# EAGLE design PowerAmpTA7270 (EAGLE 6.5.0)
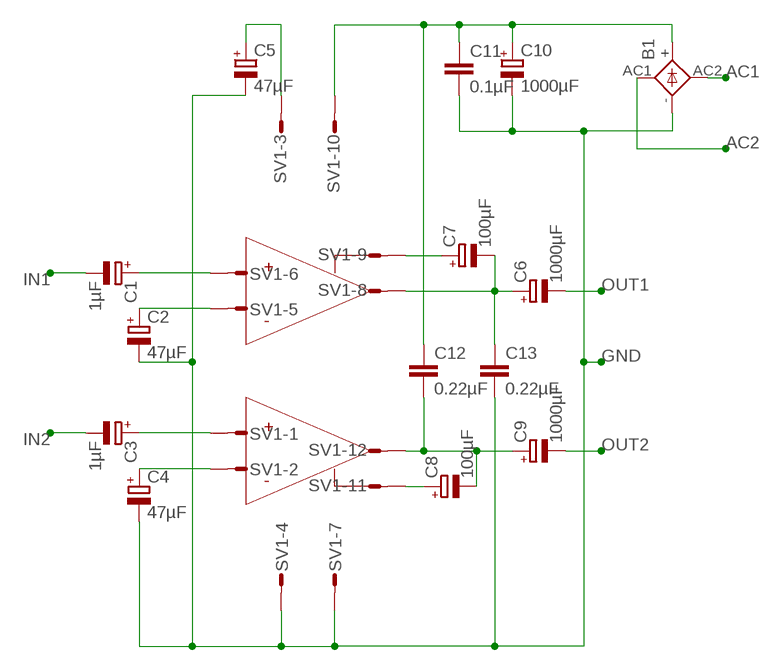
[diagram p0: schematic, sheet 1]

## Parts
B1  FB15A  [FB15A]
C1  1µF  CPOL-EUE15-5AXIAL  [E15-5]
C2  47µF  CPOL-EUB45181B  [B45181B]
C3  1µF  CPOL-EUE15-5AXIAL  [E15-5]
C4  47µF  CPOL-EUB45181B  [B45181B]
C5  47µF  CPOL-EUB45181B  [B45181B]
C6  1000µF  CPOL-EUE5-13  [E5-13]
C7  100µF  CPOL-EUE3.5-10  [E3,5-10]
C8  100µF  CPOL-EUE3.5-10  [E3,5-10]
C9  1000µF  CPOL-EUE5-13  [E5-13]
C10  1000µF  CPOL-EUE45-18AXIAL  [E45-18]
C11  0.1µF  C-EU050-025X075  [C050-025X075]
C12  0.22µF  C-EU050-025X075  [C050-025X075]
C13  0.22µF  C-EU050-025X075  [C050-025X075]
SV1  S12P  [S12P]

## Nets
AC1: B1.AC2
AC2: B1.AC1
GND: B1.- C2.- C4.- C5.- C10.- C11.2 C13.2 SV1.4 SV1.7
IN1: C1.-
IN2: C3.-
N$2: C7.+ SV1.9
N$3: C6.+ C7.- C13.1 SV1.8
N$4: C8.- C9.+ C12.2 SV1.12
N$5: C8.+ SV1.11
N$6: C3.+ SV1.1
N$7: C4.+ SV1.2
N$10: C1.+ SV1.6
N$11: C2.+ SV1.5
N$13: C5.+ SV1.3
OUT1: C6.-
OUT2: C9.-
VCC: B1.+ C10.+ C11.1 C12.1 SV1.10

## Notes on the sheet
- +
- -
- +
- -

## Library data of the parts
B1 = rectifier:FB15A: FAGOR RECTIFIER grid 3 x 5 mm
C1-C10 = rcl:CPOL-EU: POLARIZED CAPACITOR, European symbol
C11-C13 = rcl:C-EU: CAPACITOR, European symbol
SV1 = con-amp-mt:S12P: AMP MT CONNECTOR; OC_FARNELL: unknown; OC_NEWARK: unknown

## Board
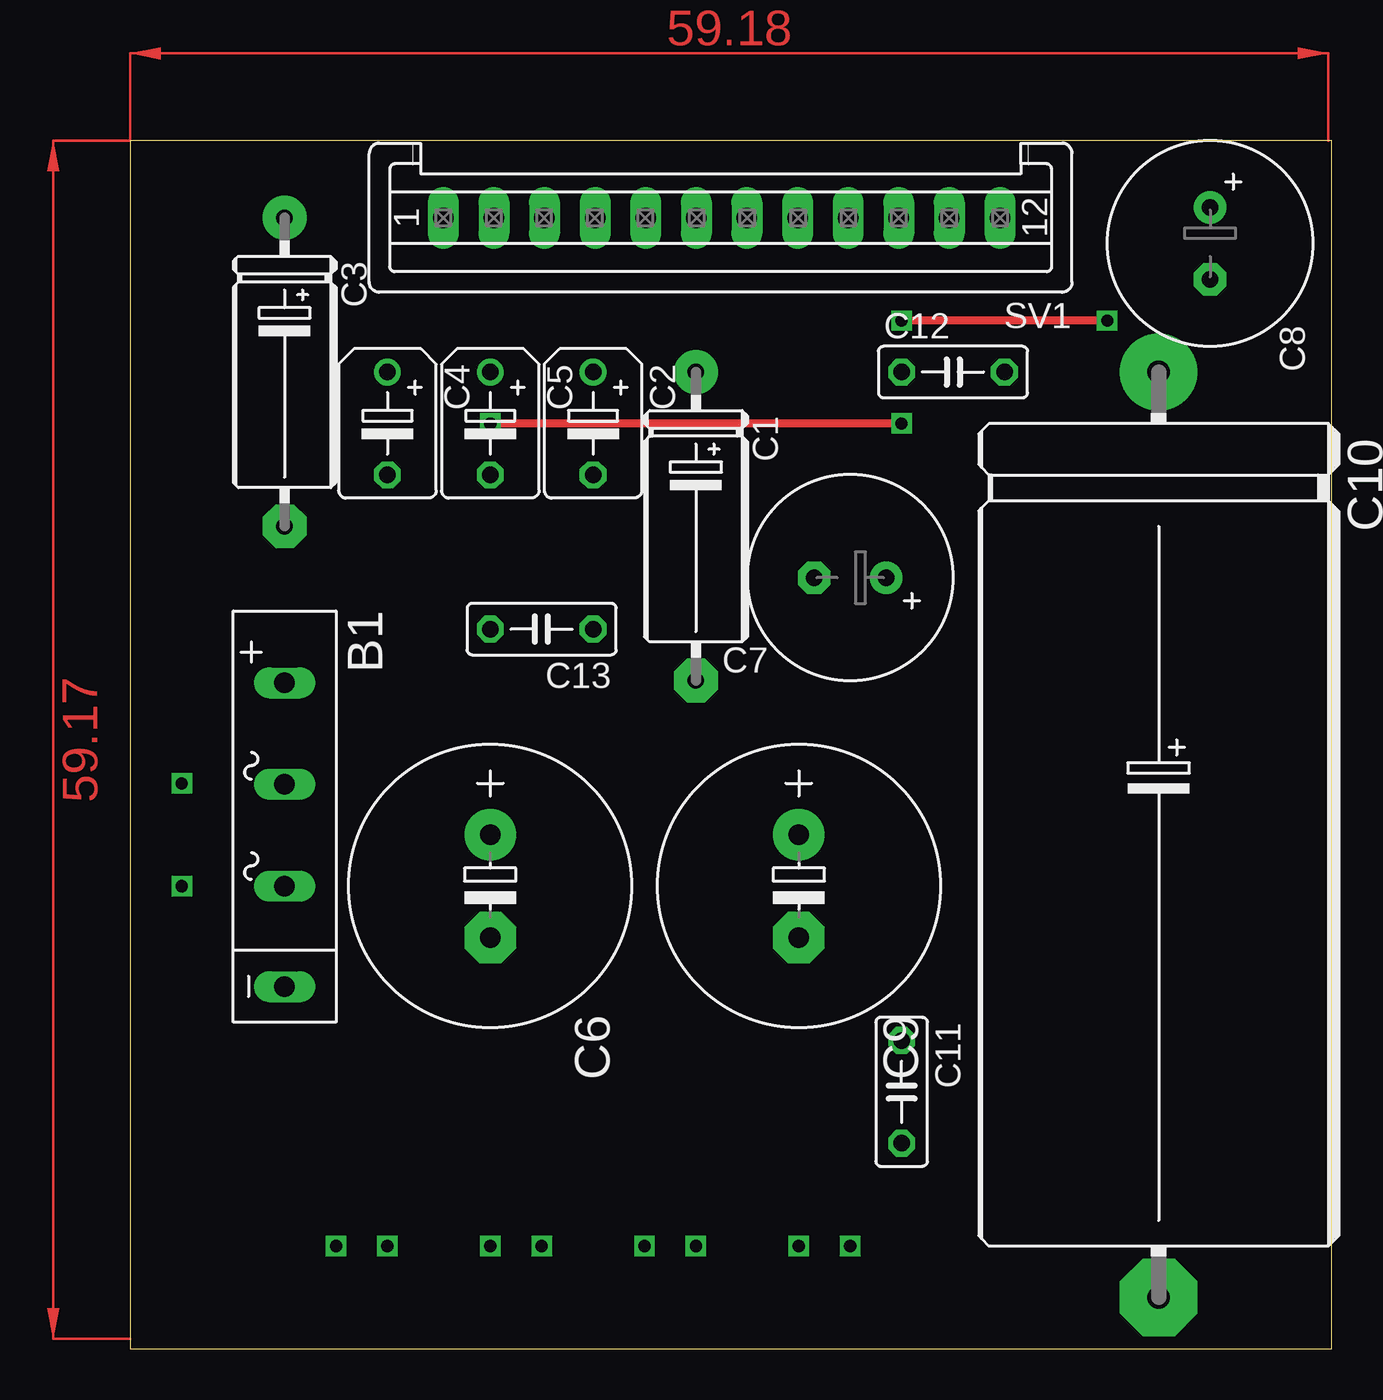
[diagram p1: board, top side]
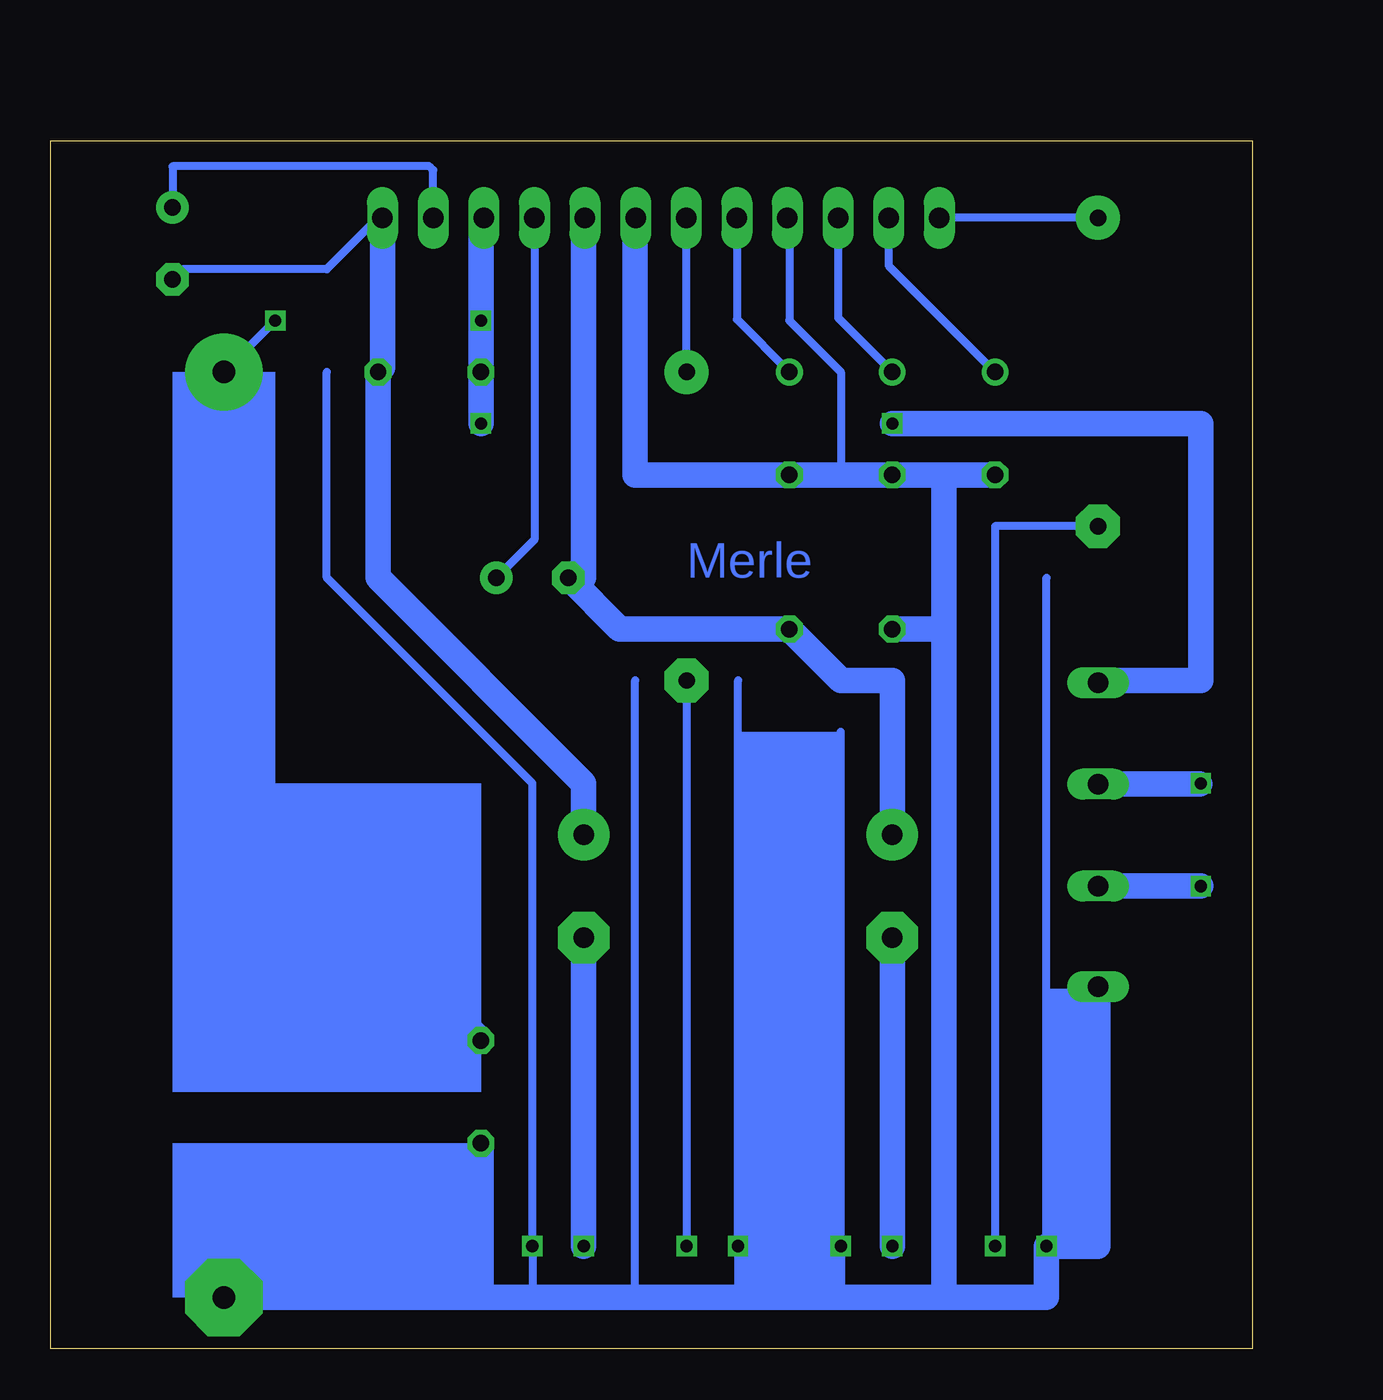
[diagram p2: board, bottom side, seen from below]

Size 59.36 x 59.68 mm. Coordinates in mm from the lower left corner, seen from the top.
Outline: 0,0 59.36,0 59.36,59.68 0,59.68 0,0
Copper layers (1*16): Top 0.035mm / dielectric 1.5mm / Bottom 0.035mm
Design rules "default": minimum track width 10mil, minimum drill 24mil, track to track 8mil, track to pad 8mil, pad to pad 8mil, via to via 8mil, smd to smd 8mil, copper to edge 40mil, drill to drill 8mil, minimum pad ring 10mil, minimum via ring 8mil, stop-mask expansion 4mil, vias tented up to drill 0mil, thermal gap 10mil

### Footprints (pad centres in the part's own frame; a part is rotated, then mirrored left to right if it is on the bottom)
FB15A = drill 1.016 long: + -7.5,0; - 7.511,0; AC1 -2.496,0; AC2 2.533,0
E15-5 = drill 0.813 pad 2.159: + -7.62,0 | drill 0.813 pad 2.159 octagon: - 7.62,0
B45181B = drill 0.813: + -2.54,0 | drill 0.813 octagon: - 2.54,0
E5-13 = drill 1.016 pad 2.54: + -2.54,0 | drill 1.016 pad 2.54 octagon: - 2.54,0
E3,5-10 = drill 0.813 pad 1.6: + -1.778,0 | drill 0.813 pad 1.6 octagon: - 1.778,0
E45-18 = drill 1.118 pad 3.81: + -22.86,0 | drill 1.118 pad 3.81 octagon: - 22.86,0
C050-025X075 = drill 0.813 octagon: 1 -2.54,0; 2 2.54,0
S12P = drill 1.016 long: 1 13.75,0; 2 11.25,0; 3 8.75,0; 4 6.25,0; 5 3.75,0; 6 1.25,0; 7 -1.25,0; 8 -3.75,0; 9 -6.25,0; 10 -8.75,0; 11 -11.25,0; 12 -13.75,0

### Placement (x,y rotation side)
B1  7.62,25.4 270 top
C1  27.94,40.64 270 top
C2  22.86,45.72 270 top
C3  7.62,48.26 270 top
C4  12.7,45.72 270 top
C5  17.78,45.72 270 top
C6  17.78,22.86 270 top
C7  35.56,38.1 180 top
C8  53.34,54.61 270 top
C9  33.02,22.86 270 top
C10  50.8,25.4 270 top
C11  38.1,12.7 270 top
C12  40.64,48.26 0 top
C13  20.32,35.56 180 top
SV1  29.21,55.88 180 top

### Tracks (layer width: path | path; a pad name or v marks a point on that pad's centre or on a via)
AC1  (via drill 0.6)
  Bottom 0.406: v2.55,22.87 v2.54,22.86
  Bottom 1.27: B1.AC2 v2.55,22.87
AC2  (via drill 0.6)
  Bottom 0.406: 2.58,27.9 v2.54,27.94
  Bottom 1.27: B1.AC1 2.58,27.9
GND  (via drill 0.6)
  Bottom 0.406: 30.48,55.9 SV1.7 | 35.56,2.54 v35.56,5.08 35.56,27.94 45.72,38.1 45.72,48.26 | 25.4,2.54 v25.4,5.08 25.4,33.02 | 20.32,2.54 v20.32,5.08 20.32,30.48 | 30.48,2.54 30.48,33.02 | v10.16,5.08 10.16,38.1 | SV1.4 22.86,55.88 22.86,50.8 20.32,48.26 20.32,43.18
  Bottom 1.27: 15.24,43.18 C4.- | C10.- 38.1,2.54 | 38.1,2.54 35.56,2.54 30.48,2.54 25.4,2.54 20.32,2.54 15.24,2.54 | 15.24,2.54 10.16,2.54 v10.16,5.08 7.62,5.08 B1.- | C11.2 38.1,2.54 | 30.48,55.9 30.48,43.18 C2.- 20.32,43.18 C5.- 15.24,43.18 | 15.24,43.18 15.24,35.56 | C13.2 15.24,35.56 | 15.24,35.56 15.24,2.54
IN1  (via drill 0.6)
  Bottom 0.406: C1.- v27.94,5.08
IN2  (via drill 0.6)
  Bottom 0.406: C3.- 12.7,40.64 v12.7,5.08
N$2
  Bottom 0.406: SV1.9 35.46,39.98 C7.+
N$3
  Bottom 0.406: C7.- 33.02,38.1 | 33.02,55.82 SV1.8
  Bottom 1.27: C6.+ 17.78,33.02 20.32,33.02 C13.1 31.24,35.56 C7.- | 33.02,38.1 33.02,55.82
N$4
  Bottom 0.406: SV1.12 43.18,55.88 45.72,53.34 52.83,53.34 C8.- | 42.96,48.48 C12.2
  Bottom 1.27: SV1.12 42.96,48.48 | C12.2 43.18,38.1 33.02,27.94 C9.+
N$5
  Bottom 0.406: SV1.11 40.46,58.24 40.64,58.42 53.34,58.42 C8.+
N$6
  Bottom 0.406: C3.+ SV1.1
N$7
  Bottom 0.406: SV1.2 17.96,53.52 C4.+
N$10
  Bottom 0.406: SV1.6 27.96,48.28 C1.+
N$11
  Bottom 0.406: SV1.5 25.46,50.86 C2.+
N$13
  Bottom 0.406: SV1.3 20.46,50.94 C5.+
OUT1  (via drill 0.6)
  Bottom 1.27: C6.- v17.78,5.08
OUT2  (via drill 0.6)
  Bottom 1.27: C9.- v33.02,5.08
VCC  (via drill 0.6)
  Top 0.406: v48.26,50.8 v38.1,50.8 | v38.1,45.72 v17.78,45.72
  Bottom 0.406: C10.+ v48.26,50.8 | 38.1,55.74 SV1.10 | 7.62,33.02 B1.+
  Bottom 1.27: 38.1,55.74 v38.1,50.8 C12.1 v38.1,45.72 | v17.78,45.72 2.54,45.72 2.54,33.02 7.62,33.02 | C10.+ 50.8,27.94 C11.1
(copper drawn outside any net)
  shapes: Bottom area x6, Top area x2

### Text on the board
Bottom: Merle